# Altium schematic sheet PROCESSOR.SchDoc
size Tabloid; SheetNumber: 3; SheetTotal: 9
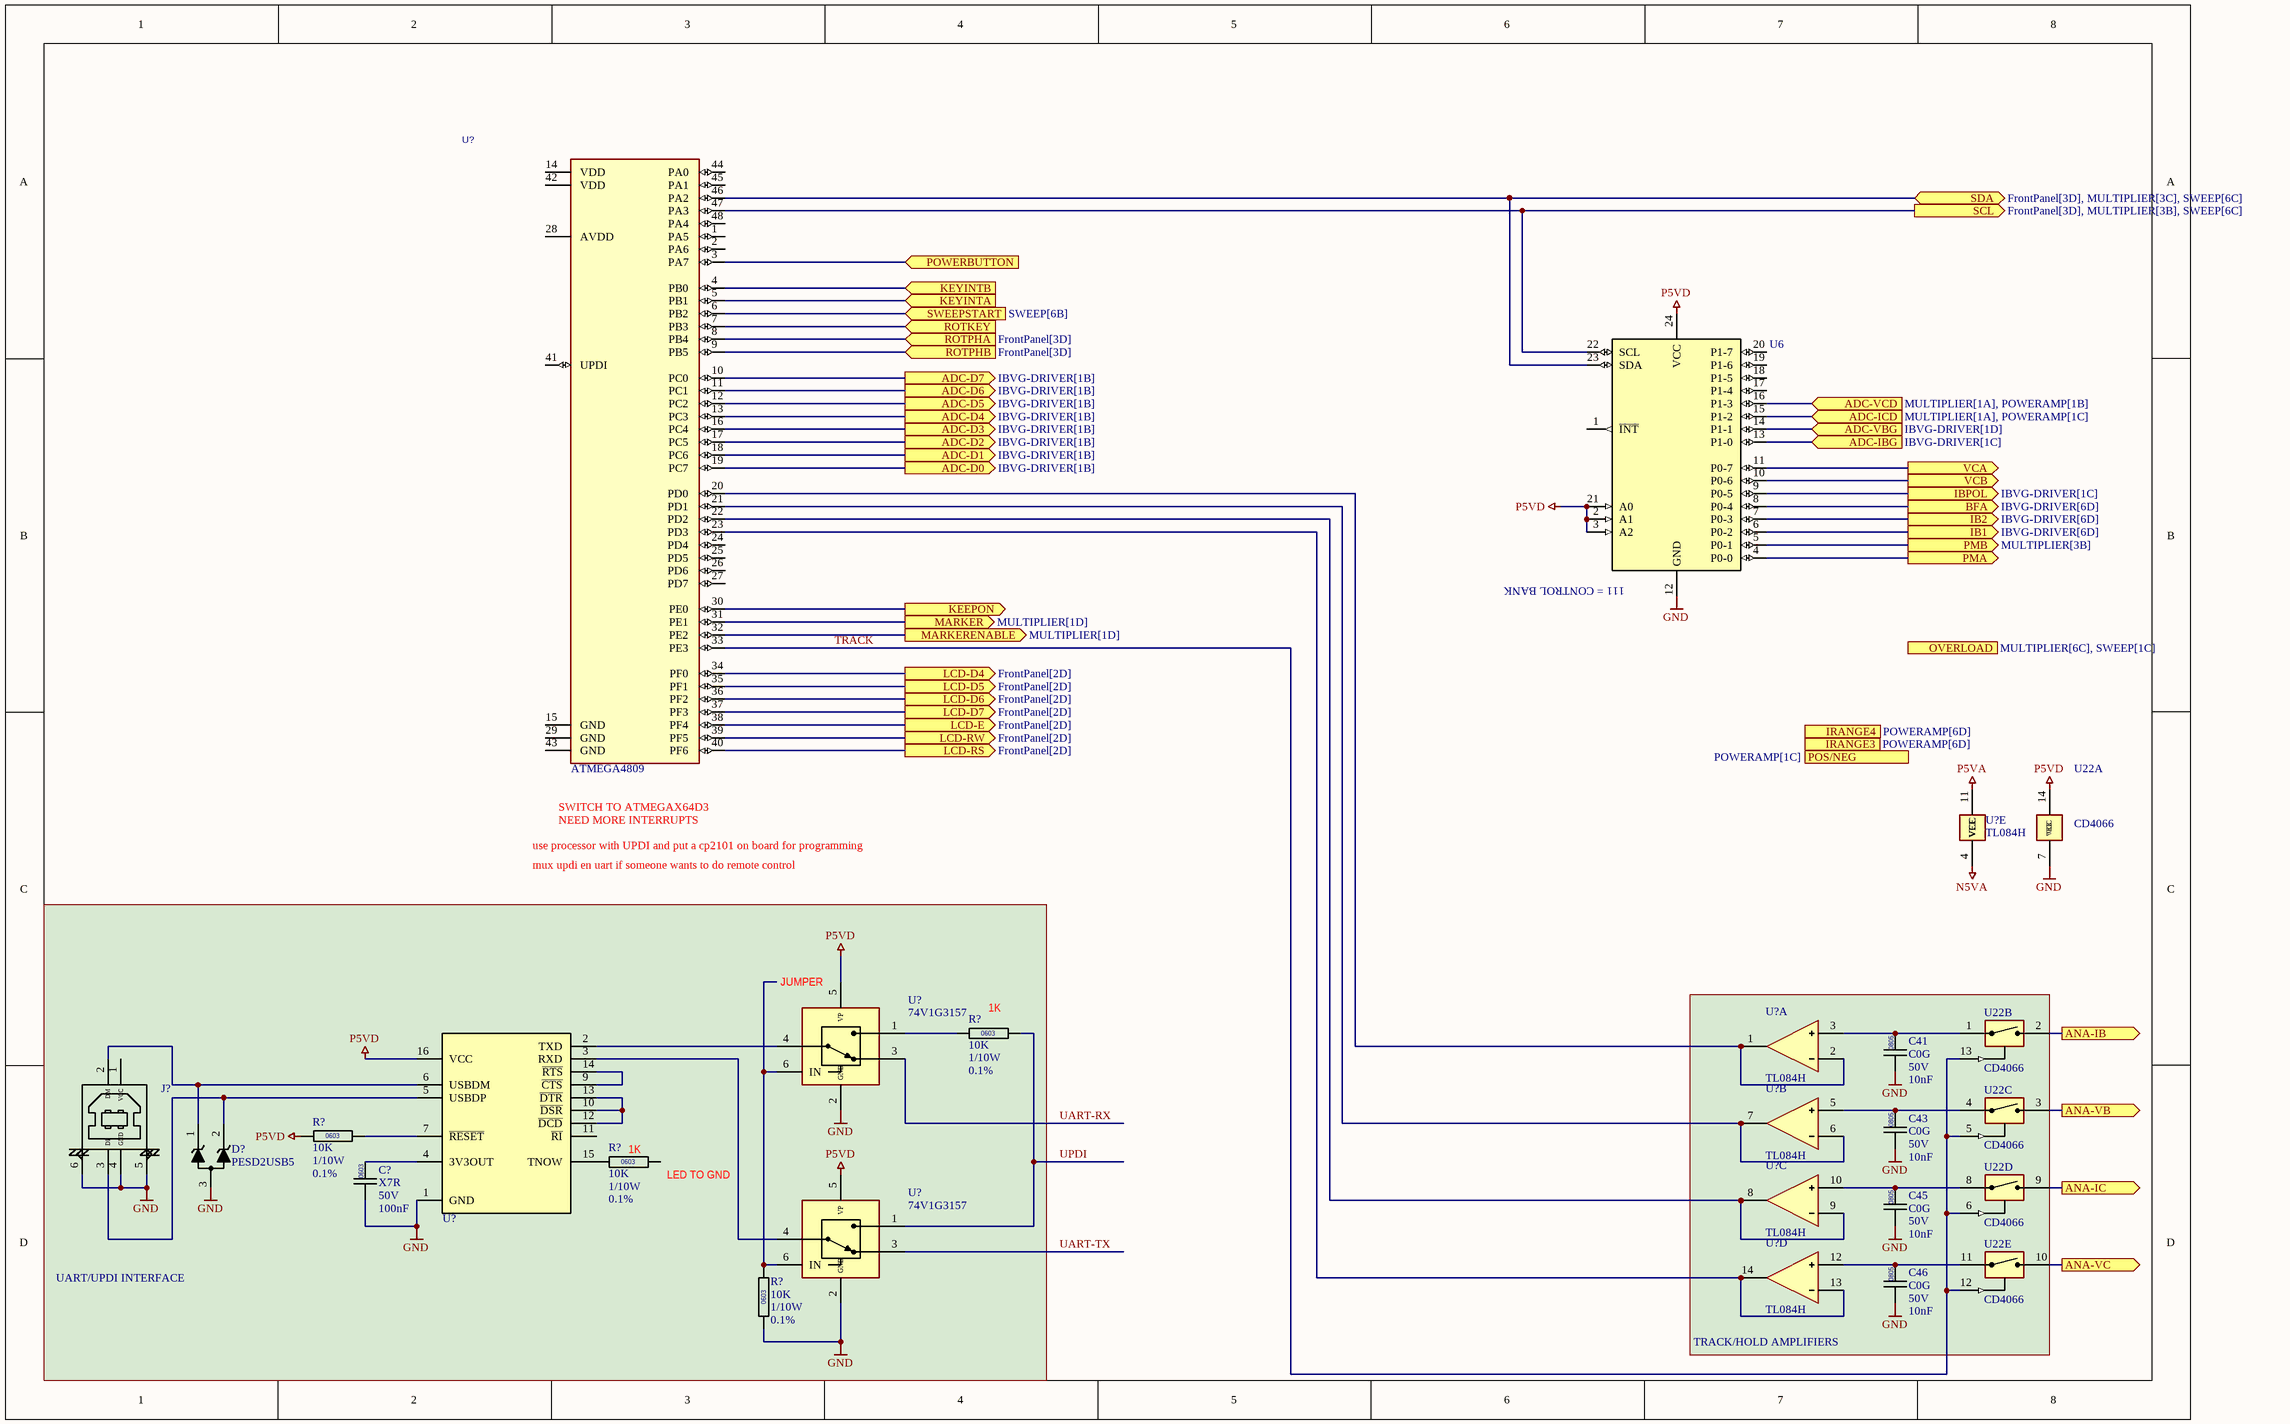
[diagram p0: PROCESSOR.SchDoc]

## Parts
(Parts that share a designator on the sheet are numbered #1, #2 ... from top to bottom, then left to right.)
C41  Dielectric: C0G  Voltage: 50V  Capacitance: 10nF  [CAPC0805]  (hidden comment: CAP0805)
C43  Dielectric: C0G  Voltage: 50V  Capacitance: 10nF  [CAPC0805]  (hidden comment: CAP0805)
C45  Dielectric: C0G  Voltage: 50V  Capacitance: 10nF  [CAPC0805]  (hidden comment: CAP0805)
C46  Dielectric: C0G  Voltage: 50V  Capacitance: 10nF  [CAPC0805]  (hidden comment: CAP0805)
C?  Dielectric: X7R  Voltage: 50V  Capacitance: 100nF  [CAPC0603]  (hidden comment: CAP0603)
D?  PESD2USB5  [SOT23]
J?  CONN-CUI-UJ2-BH-BL1-TH  (value not drawn)
R?#1  value 10K  Power: 1/10W  Tolerance: 0.1%  [RESC0603]  (hidden comment: RESC0603)
R?#2  value 10K  Power: 1/10W  Tolerance: 0.1%  [RESC0603]  (hidden comment: RESC0603)
R?#3  value 10K  Power: 1/10W  Tolerance: 0.1%  [RESC0603]  (hidden comment: RESC0603)
R?#4  value 10K  Power: 1/10W  Tolerance: 0.1%  [RESC0603]  (hidden comment: RESC0603)
U6  PCAL9555  (value not drawn)
U22  CD4066  [SO127P600-14N]  (parts A,B,C,D,E of 5)
U?#1  ATMEGA4809  [QFN50P700X700X-44-TH520X520]
U?#2  TL084H  [SO127P600-14N]  (part E of 5)
U?#3  74V1G3157  [SOT23-6]
U?#4  TL084H  [SO127P600-14N]  (part A of 5)
U?#5  CP2102  [SO127P600-16N]  (value not drawn)
U?#6  TL084H  [SO127P600-14N]  (part B of 5)
U?#7  TL084H  [SO127P600-14N]  (part C of 5)
U?#8  74V1G3157  [SOT23-6]
U?#9  TL084H  [SO127P600-14N]  (part D of 5)

## Blocks framed on the sheet
TRACK/HOLD AMPLIFIERS: C41 C43 C45 C46 U22 U?#4 U?#6 U?#7 U?#9

## Ports
ADC-D0 (out, see IBVG-DRIVER[1B]), ADC-D1 (out, see IBVG-DRIVER[1B]), ADC-D2 (out, see IBVG-DRIVER[1B]), ADC-D3 (out, see IBVG-DRIVER[1B]), ADC-D4 (out, see IBVG-DRIVER[1B]), ADC-D5 (out, see IBVG-DRIVER[1B]), ADC-D6 (out, see IBVG-DRIVER[1B]), ADC-D7 (out, see IBVG-DRIVER[1B]), ADC-IBG (in, see IBVG-DRIVER[1C]), ADC-ICD (in, see MULTIPLIER[1A], POWERAMP[1C]), ADC-VBG (in, see IBVG-DRIVER[1D]), ADC-VCD (in, see MULTIPLIER[1A], POWERAMP[1B]), ANA-IB (out), ANA-IC (out), ANA-VB (out), ANA-VC (out), BFA (out, see IBVG-DRIVER[6D]), IB1 (out, see IBVG-DRIVER[6D]), IB2 (out, see IBVG-DRIVER[6D]), IBPOL (out, see IBVG-DRIVER[1C]), IRANGE3 (out, see POWERAMP[6D]), IRANGE4 (out, see POWERAMP[6D]), KEEPON (out), KEYINTA (in), KEYINTB (in), LCD-D4 (out, see FrontPanel[2D]), LCD-D5 (out, see FrontPanel[2D]), LCD-D6 (out, see FrontPanel[2D]), LCD-D7 (out, see FrontPanel[2D]), LCD-E (out, see FrontPanel[2D]), LCD-RS (out, see FrontPanel[2D]), LCD-RW (out, see FrontPanel[2D]), MARKER (out, see MULTIPLIER[1D]), MARKERENABLE (out, see MULTIPLIER[1D]), OVERLOAD (in, see MULTIPLIER[6C], SWEEP[1C]), PMA (out), PMB (out, see MULTIPLIER[3B]), POS/NEG (out, see POWERAMP[1C]), POWERBUTTON (in), ROTKEY (in), ROTPHA (in, see FrontPanel[3D]), ROTPHB (in, see FrontPanel[3D]), SCL (out, see FrontPanel[3D], MULTIPLIER[3B], SWEEP[6C]), SDA (bidir, see FrontPanel[3D], MULTIPLIER[3C], SWEEP[6C]), SWEEPSTART (in, see SWEEP[6B]), VCA (out), VCB (out)

## Nets
GND: C41.2 C43.2 C45.2 C46.2 C?.2 D?.3(A) J?.4(GND) J?.5(NO) J?.6(NO) R?#4.2 U6.12(GND) U22.7(VEE) U?#3.2(GND) U?#5.1(GND) U?#8.2(GND)
N5VA: U?#2.4(VCC)
P5VA: U?#2.11(VEE)
P5VD: R?#2.2 U6.2(A1) U6.3(A2) U6.21(A0) U6.24(VCC) U22.14(VCC) U?#3.5(VP) U?#5.16(VCC) U?#8.5(VP)
ADC-D0: U?#1.19(PC7) ; port ADC-D0
ADC-D1: U?#1.18(PC6) ; port ADC-D1
ADC-D2: U?#1.17(PC5) ; port ADC-D2
ADC-D3: U?#1.16(PC4) ; port ADC-D3
ADC-D4: U?#1.13(PC3) ; port ADC-D4
ADC-D5: U?#1.12(PC2) ; port ADC-D5
ADC-D6: U?#1.11(PC1) ; port ADC-D6
ADC-D7: U?#1.10(PC0) ; port ADC-D7
ADC-IBG: U6.13(P1-0) ; port ADC-IBG
ADC-ICD: U6.15(P1-2) ; port ADC-ICD
ADC-VBG: U6.14(P1-1) ; port ADC-VBG
ADC-VCD: U6.16(P1-3) ; port ADC-VCD
ANA-IB: U22.2 ; port ANA-IB
ANA-IC: U22.9 ; port ANA-IC
ANA-VB: U22.3 ; port ANA-VB
ANA-VC: U22.10 ; port ANA-VC
BFA: U6.8(P0-4) ; port BFA
IB1: U6.6(P0-2) ; port IB1
IB2: U6.7(P0-3) ; port IB2
IBPOL: U6.9(P0-5) ; port IBPOL
KEEPON: U?#1.30(PE0) ; port KEEPON
KEYINTA: U?#1.5(PB1) ; port KEYINTA
KEYINTB: U?#1.4(PB0) ; port KEYINTB
LCD-D4: U?#1.34(VCC) ; port LCD-D4
LCD-D5: U?#1.35(GND) ; port LCD-D5
LCD-D6: U?#1.36(PF2) ; port LCD-D6
LCD-D7: U?#1.37(PF3) ; port LCD-D7
LCD-E: U?#1.38(PF4) ; port LCD-E
LCD-RS: U?#1.40(PF6) ; port LCD-RS
LCD-RW: U?#1.39(PF5) ; port LCD-RW
MARKER: U?#1.31(PE1) ; port MARKER
MARKERENABLE: U?#1.32(PE2) ; port MARKERENABLE
PMA: U6.4(P0-0) ; port PMA
PMB: U6.5(P0-1) ; port PMB
POWERBUTTON: U?#1.3(PA7) ; port POWERBUTTON
ROTKEY: U?#1.7(PB3) ; port ROTKEY
ROTPHA: U?#1.8(PB4) ; port ROTPHA
ROTPHB: U?#1.9(PB5) ; port ROTPHB
SCL: U6.22(SCL) U?#1.47(PA3) ; port SCL
SDA: U6.23(SDA) U?#1.46(PA2) ; port SDA
SWEEPSTART: U?#1.6(PB2) ; port SWEEPSTART
TRACK: U22.5 U22.6 U22.12 U22.13 U?#1.33(PE3)
UART-RX: U?#3.3(B1)
UART-TX: U?#8.3(B1)
UPDI: R?#1.1 U?#8.1(NO)
VCA: U6.11(P0-7) ; port VCA
VCB: U6.10(P0-6) ; port VCB
NetC41_1: C41.1 U22.1 U?#4.3(+)
NetC43_1: C43.1 U22.4 U?#6.5(+)
NetC45_1: C45.1 U22.8 U?#7.10(+)
NetC46_1: C46.1 U22.11 U?#9.12(+)
NetC?_1: C?.1 U?#5.4(3V3OUT)
NetD?_1: D?.1(K) J?.2(DM) U?#5.6(USBDM)
NetD?_2: D?.2(A) J?.3(DP) U?#5.5(USBDP)
NetR?#1_2: R?#1.2 U?#3.1(NO)
NetR?#2_1: R?#2.1 U?#5.7(~{RESET})
NetR?#3_2: R?#3.2 U?#5.15(TNOW)
NetR?#4_1: R?#4.1 U?#3.6(IN) U?#8.6(IN)
NetU?#1_20: U?#1.20(PD0) U?#4.1(O) U?#4.2(-)
NetU?#1_21: U?#1.21(PD1) U?#6.6(-) U?#6.7(O)
NetU?#1_22: U?#1.22(PD2) U?#7.8(O) U?#7.9(-)
NetU?#1_23: U?#1.23(GND) U?#9.13(-) U?#9.14(O)
NetU?#3_4: U?#3.4(COM) U?#5.2(TXD)
NetU?#5_3: U?#5.3(RXD) U?#8.4(COM)
NetU?#5_9: U?#5.9(~{CTS}) U?#5.14(~{RTS})
NetU?#5_10: U?#5.10(~{DSR}) U?#5.12(~{DCD}) U?#5.13(~{DTR})

Not connected (* = marked no-connect by the designer): J? 1(VCC); R?#3 1; U6 1(~{INT}) 17(P1-4) 18(P1-5) 19(P1-6) 20(P1-7); U?#1 1(PA5) 2(PA6) 14(VDD) 15(GND) 24(PD4) 25(PD5) 26(PD6) 27(PD7) 28(AVDD) 29(GND) 41(UPDI) 42(VDD) 43(GND) 44(AVCC) 45(PA1) 48(PA4); U?#5 11(~{RI})

## Notes on the sheet
- (near U6) 111 = CONTROL BANK
- use processor with UPDI and put a cp2101 on board for programming
- SWITCH TO ATMEGAX64D3
- NEED MORE INTERRUPTS
- mux updi en uart if someone wants to do remote control
- (near U?#3) JUMPER
- (near R?#1) 1K
- (near R?#3) 1K
- (near R?#3) LED TO GND
- UART/UPDI INTERFACE
- (in symbol CAPC-0805-10nF-50V-C0G) 0805
- (in symbol RESC-0603-10K-0.1%-1/10W) 0603

## Library data of the parts
C41 C43 C45 C46 = CAPC-0805-10nF-50V-C0G: CAPACITOR,CERAMIC,10nF,100V,C0G,0805; Manufacturer 1: KEMET; Manufacturer Part Number 1: C0805C103K5GEC7210; Package / Case: 0805 (2012 metric); Location: *; DIGIKEY: 399-C0805C103K5GEC7210CT-ND
C? = CAPC-0603-100nF-50V-X7R: CAPACITOR,CERAMIC,100nF,50V,X7R,0603; Manufacturer 1: KEMET; Manufacturer Part Number 1: C0603C104K5RACTU; Package / Case: 0603; Location: *; Supplier 1: Mouser; Supplier Part Number 1: 80-C0603C104K5R7867; Supplier 2: Mouser; Supplier Part Number 2: 80-C0603C104K5R7411; Supplier 3: Avnet; Supplier Part Number 3: KGM15BR71H104KT; Supplier 4: Digikey; Supplier Part Number 4: 1276-1000-1-ND; LCSC: C127833; MOUSER: 80-C0603C104K5R
D? = TVS-NEXPERIA-PESD2USB5UX-TR: DIODE,TVS,DUAL,NIDIRETIONAL,USB,PESD2USB5UX-TR,SOT23; DIGIKEY: 1727-PESD2USB5UX-CT-ND; Manufacturer 1: NEXPERIA; Manufacturer Part Number 1: PESD2USB5UX-TR
J? = CONN-CUI-UJ2-BH-BL1-TH: CONN,USB2.0,B,RA,BLUE
R?#1-R?#4 = RESC-0603-10K-0.1%-1/10W: RESISTOR,10K,0.1%,100mW,0603 (1608); Location: *
U6 = IC-NEXPERIA-PCAL9555A: I2C,16BIT AGILE I/O EXPANDER,INT,NEXPERIA,PCAL95555,TSSOP24; Manufacturer Part Number 1: PCAL9555APW,118; DIGIKEY: 568-9928-1-ND; Manufacturer 1: NEXPERIA
U22 = IC-TI-CD4066-SO14: IC,ANALOG,4XSPST ANALOG SWITCH,NO,TI,CD4016,SO14; Manufacturer Part Number 1: CD4066BM96; DIGIKEY: 296-14475-1-ND; Manufacturer 1: TI
U?#1 = IC-ATMEL-ATMEGA4809-QFP48: IC,CPU,ATMEGA4809,QFP48
U?#2 U?#4 U?#6 U?#7 U?#9 = IC-TI-TL084-SO14: IC,OPAMP JFET,QUAD,TL084HIDR,SO14; Manufacturer 1: TI; Manufacturer Part Number 1: TL082HIDR; MOUSER: 595-TL082HIDR
U?#3 U?#8 = IC-TI-SN74LVC1G3157DBVR: IC,ANALOG,SPDT ANALOG SWITCH,SINGLEGATE,TI,SN74LVC1G3157DBVR,SOT23-6; DIGIKEY: 296-14908-1-ND; Manufacturer 1: TI; Manufacturer Part Number 1: SN74LVC1G3157DBVR
U?#5 = IC-WCH-CH340B: IC,XCVR,USB UART WITH XTAL AND EEPROM,WCH,CH340G-SO16; Manufacturer Part Number 1: FT231XS-R; Manufacturer 1: WCH; MOUSER: CH340B